# EAGLE design untitled (EAGLE 5.10)
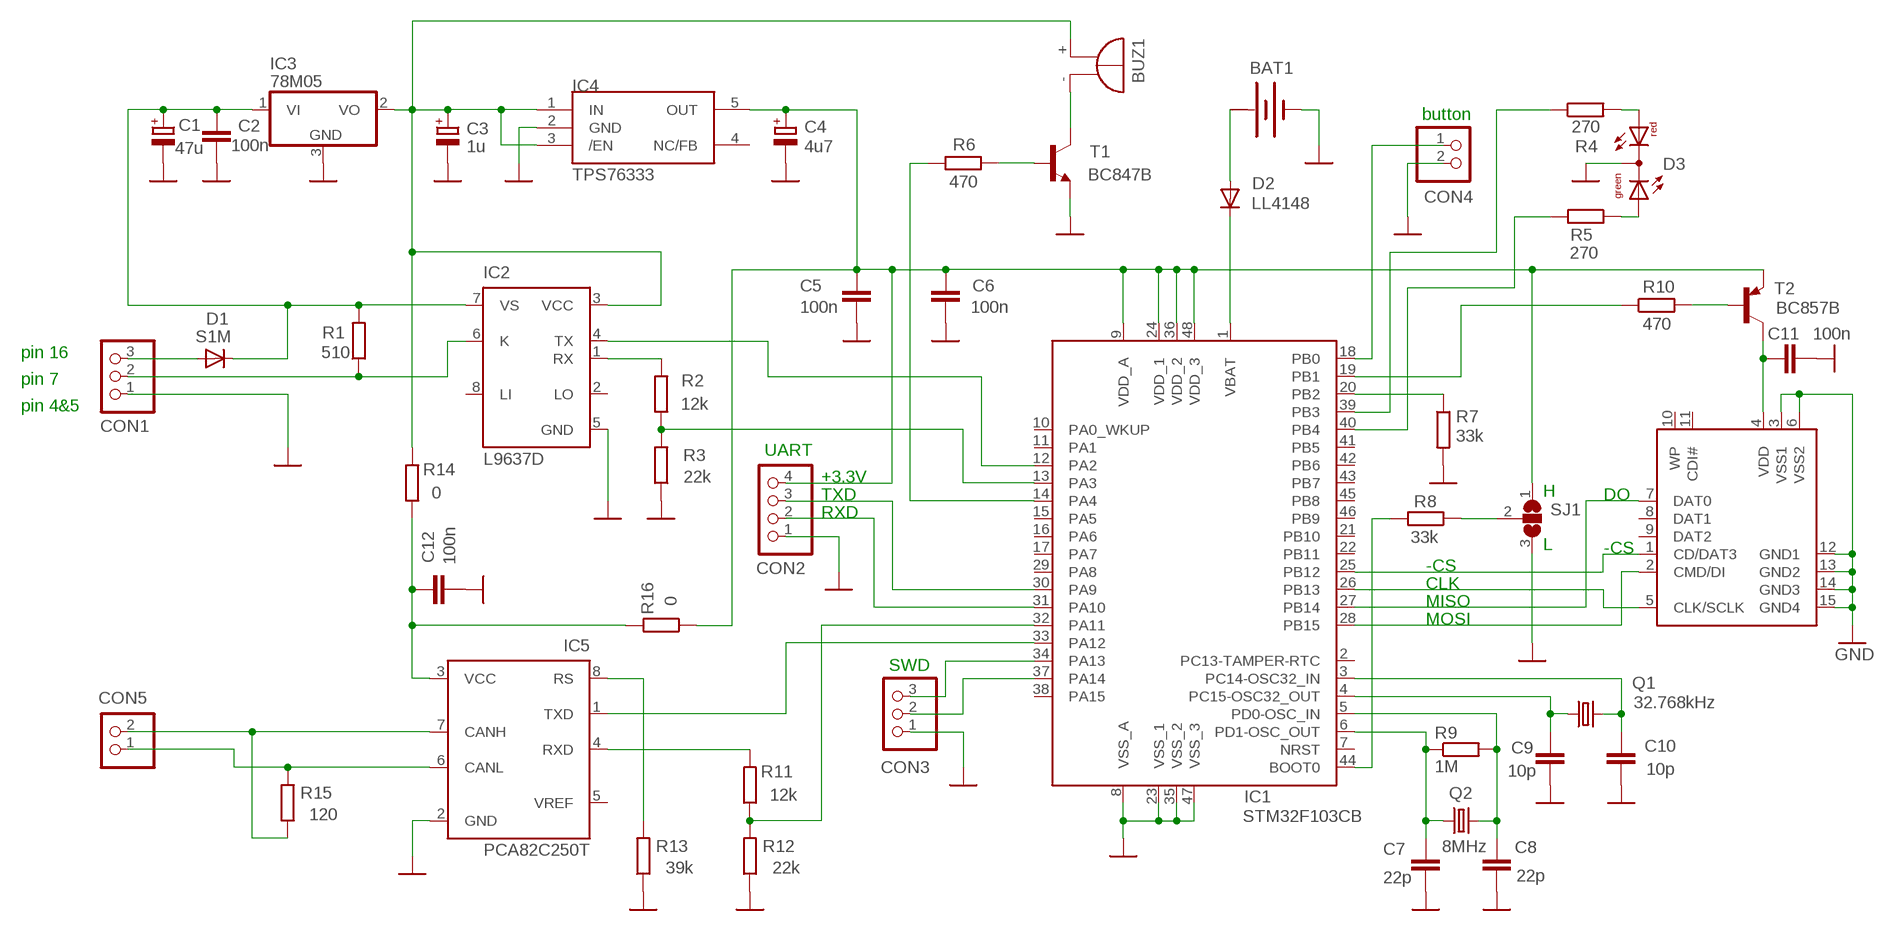
[diagram p0: schematic, sheet 1]

## Parts
BAT1  BATTERY  [BATTERY]
BUZ1  F/TMB  [F/TMB]
C1  47u  CPOL-EUE2.5-5  [E2,5-5]
C2  100n  C-EUC1206  [C1206]
C3  1u  CPOL-EUSMCA  [SMC_A]
C4  4u7  CPOL-EUSMCA  [SMC_A]
C5  100n  C-EUC0603  [C0603]
C6  100n  C-EUC0603  [C0603]
C7  22p  C-EUC0603  [C0603]
C8  22p  C-EUC0603  [C0603]
C9  10p  C-EUC0603  [C0603]
C10  10p  C-EUC0603  [C0603]
C11  100n  C-EUC0603  [C0603]
C12  100n  C-EUC0603  [C0603]
CON1  PINHD-1X3  [1X03]
CON2  PINHD-1X4  [1X04]
CON3  PINHD-1X3  [1X03]
CON4  PINHD-1X2  [1X02]
CON5  PINHD-1X2  [1X02]
D1  S1M  DIODE-SMB  [SMB]
D2  LL4148  DIODE-MINIMELF  [MINIMELF]
D3  DUOLED-RG-C  [DUOLED-C-5MM]
IC1  STM32F103CB  STM32F101RB  [LQFP48]
IC2  L9637D  [SO08]
IC3  78M05  7805DT  [TO252]
IC4  TPS76333  TPS769XX  [SOT23-5L]
IC5  PCA82C250T  [SO8]
Q1  32.768kHz  CRYSTALTC26H  [TC26H]
Q2  8MHz  CRYSTALHC49S  [HC49/S]
R1  510  R-EU_R1206  [R1206]
R2  12k  R-EU_R0603  [R0603]
R3  22k  R-EU_R0603  [R0603]
R4  270  R-EU_R0603  [R0603]
R5  270  R-EU_R0603  [R0603]
R6  470  R-EU_R0603  [R0603]
R7  33k  R-EU_R0603  [R0603]
R8  33k  R-EU_R0603  [R0603]
R9  1M  R-EU_R0603  [R0603]
R10  470  R-EU_R0603  [R0603]
R11  12k  R-EU_R0603  [R0603]
R12  22k  R-EU_R0603  [R0603]
R13  39k  R-EU_R0603  [R0603]
R14  0  R-EU_R0603  [R0603]
R15  120  R-EU_R0603  [R0603]
R16  0  R-EU_R0603  [R0603]
SJ1  SJ2W  [SJ_2]
T1  BC847B  BC847ALT1SMD  [SOT23]
T2  BC857B  BC857ALT1SMD  [SOT23-BEC]
U$2  SDCARDVAR1  [SDCMF-10915W010]

## Nets
GND: BAT1.- C1.- C2.2 C3.- C4.- C5.2 C6.2 C7.2 C8.2 C9.2 C10.2 C11.2 C12.2 CON1.1 CON2.1 CON3.1 CON4.2 D3.C IC1.8(VSS_A) IC1.23(VSS_1) IC1.35(VSS_2) IC1.47(VSS_3) IC2.5(GND) IC3.3(GND) IC4.2(GND) IC5.2(GND) R3.1 R7.2 R12.1 R13.1 SJ1.3 T1.2(E) U$2.3(VSS1) U$2.6(VSS2) U$2.12(GND1) U$2.13(GND2) U$2.14(GND3) U$2.15(GND4)
N$1: IC1.25(PB12) U$2.1(CD/DAT3)
N$2: IC1.19(PB1) R10.1
N$3: C8.1 IC1.5(PD0-OSC_IN) Q2.2 R9.2
N$4: C7.1 IC1.6(PD1-OSC_OUT) Q2.1 R9.1
N$5: R8.1 SJ1.2
N$6: D3.AR R4.2
N$7: IC1.28(PB15) U$2.2(CMD/DI)
N$8: C9.1 IC1.4(PC15-OSC32_OUT) Q1.1
N$9: C10.1 IC1.3(PC14-OSC32_IN) Q1.2
N$10: IC1.12(PA2) IC2.4(TX)
N$11: IC1.39(PB3) R4.1
N$12: BUZ1.+ C3.+ IC2.3(VCC) IC3.2(VO) IC4.1(IN) IC4.3(/EN) R14.2
N$13: IC1.13(PA3) R2.1 R3.2
N$14: IC2.1(RX) R2.2
N$16: CON1.2 IC2.6(K) R1.1
N$17: IC1.26(PB13) U$2.5(CLK/SCLK)
N$18: D2.C IC1.1(VBAT)
N$19: CON2.3 IC1.30(PA9)
N$20: IC1.40(PB4) R5.2
N$21: D3.AX(AG) R5.1
N$22: CON1.3 D1.A
N$23: CON3.3 IC1.34(PA13)
N$24: C1.+ C2.1 D1.C IC2.7(VS) IC3.1(VI) R1.2
N$25: IC1.20(PB2) R7.1
N$26: CON3.2 IC1.37(PA14)
N$27: BUZ1.- T1.3(C)
N$28: R10.2 T2.B
N$29: R6.2 T1.1(B)
N$30: IC1.14(PA4) R6.1
N$31: IC1.44(BOOT0) R8.2
N$32: C11.1 T2.C U$2.4(VDD)
N$33: CON2.2 IC1.31(PA10)
N$34: CON4.1 IC1.18(PB0)
N$36: BAT1.+ D2.A
N$37: IC1.27(PB14) U$2.7(DAT0)
N$44: IC1.33(PA12) IC5.1(TXD)
N$45: IC1.32(PA11) R11.1 R12.2
N$46: IC5.4(RXD) R11.2
N$47: IC5.8(RS) R13.2
N$48: CON5.2 IC5.7(CANH) R15.1
N$49: CON5.1 IC5.6(CANL) R15.2
N$50: C12.1 IC5.3(VCC) R14.1 R16.2
N$82: C4.+ C5.1 C6.1 CON2.4 IC1.9(VDD_A) IC1.24(VDD_1) IC1.36(VDD_2) IC1.48(VDD_3) IC4.5(OUT) R16.1 SJ1.1 T2.E
Unconnected: IC1.2(PC13-TAMPER-RTC) IC1.7(NRST) IC1.10(PA0_WKUP) IC1.11(PA1) IC1.15(PA5) IC1.16(PA6) IC1.17(PA7) IC1.21(PB10) IC1.22(PB11) IC1.29(PA8) IC1.38(PA15) IC1.41(PB5) IC1.42(PB6) IC1.43(PB7) IC1.45(PB8) IC1.46(PB9) IC2.2(LO) IC2.8(LI) IC4.4(NC/FB) IC5.5(VREF) U$2.8(DAT1) U$2.9(DAT2) U$2.10(WP) U$2.11(CDI#)

## Notes on the sheet
- button
- pin 16
- pin 7
- pin 4&5
- UART
- +3.3V
- TXD | H | DO
- RXD
- L | -CS
- -CS
- CLK
- MISO
- MOSI
- SWD

## Power pins joined to a net without a drawn wire
+: BAT1.+@1(+)

## Library data of the parts
BAT1 = special:BATTERY: BATTERY
BUZ1 = buzzer:F/TMB: BUZZER Source: Buerklin
C1 C3 C4 = rcl:CPOL-EU: POLARIZED CAPACITOR, European symbol
C2 C5-C12 = rcl:C-EU: CAPACITOR, European symbol
CON1 CON3 = pinhead:PINHD-1X3: PIN HEADER
CON2 = pinhead:PINHD-1X4: PIN HEADER
CON4 CON5 = pinhead:PINHD-1X2: PIN HEADER
D1 D2 = diode:DIODE-: DIODE
D3 = led:DUOLED-RG-C: DUO LED 2 colors (red/green), 5 mm, round, common Cathode www.ligitek.com or other producers.
IC1 = stm32:STM32F101RB
IC2 = st-microelectronics:L9637D: ISO 9141 INTERFACE Source: 1765.pdf
IC3 = linear:78*: Positive VOLTAGE REGULATOR Source: http://cache.national.com/ds/LM/LM78L05.pdf http://www.fairchildsemi.com/ds/LM/LM7805.pdf
IC4 = tps769xx:TPS769XX
IC5 = micro-philips:PCA82C250: CAN CONTROLLER INTERFACE
Q1 Q2 = crystal:CRYSTAL: CRYSTAL
R1-R16 = rcl:R-EU_: RESISTOR, European symbol
SJ1 = jumper:SJ2W: SMD solder JUMPER
T1 = transistor-npn:BC847*: NPN Transistor
T2 = transistor-pnp:BC857*: PNP Transistror
U$2 = kingfont_sdcmf10915w010:SDCARD: SD card connector KINGFONT SDCMF-10915W010

## Board
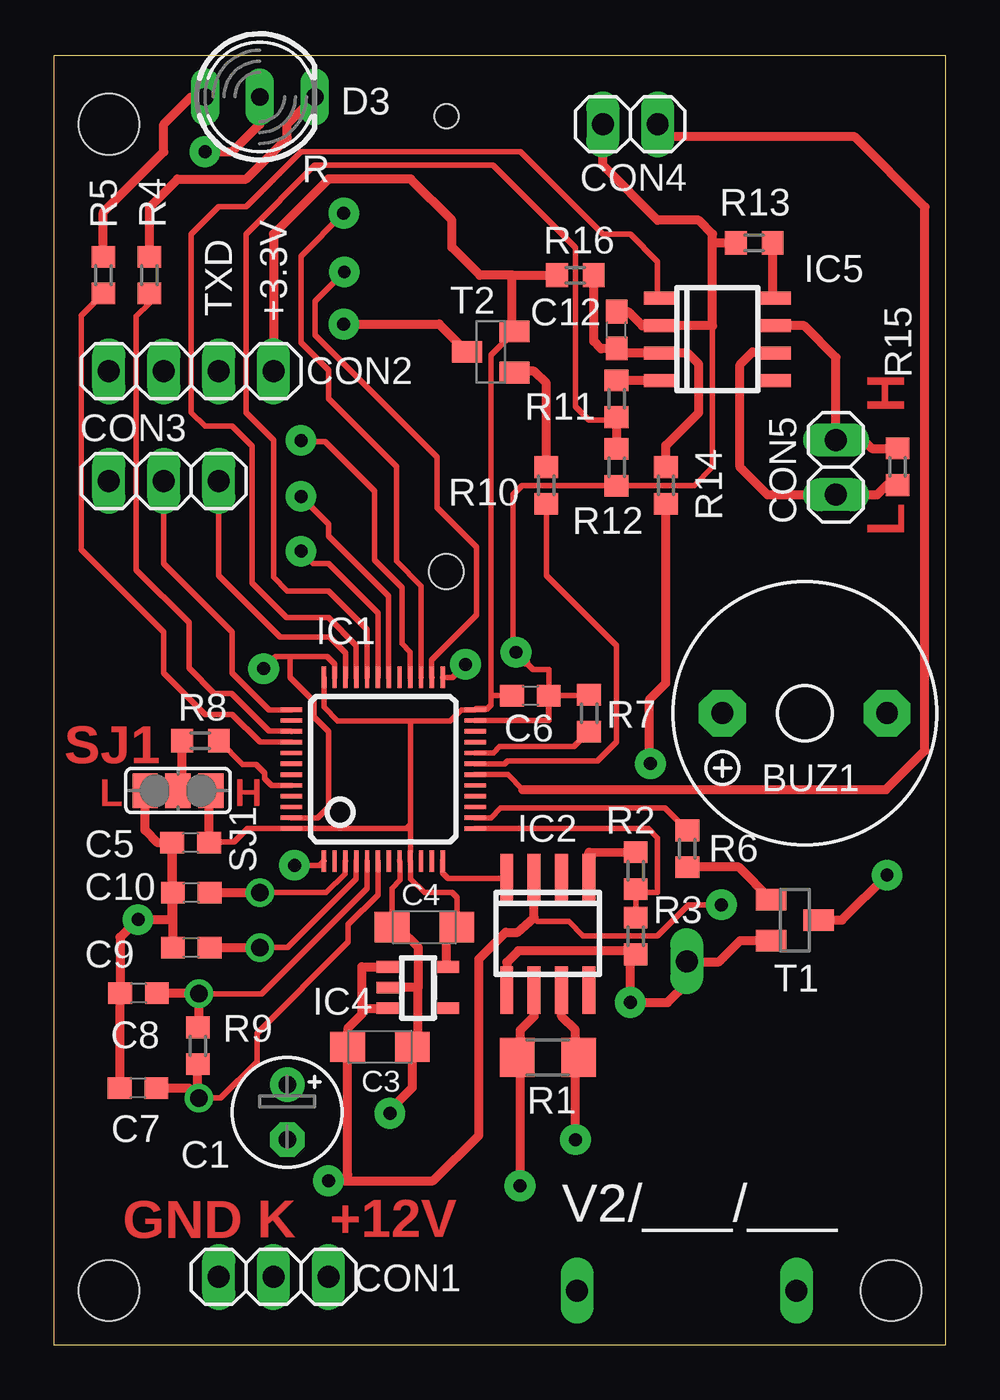
[diagram p1: board, top side]
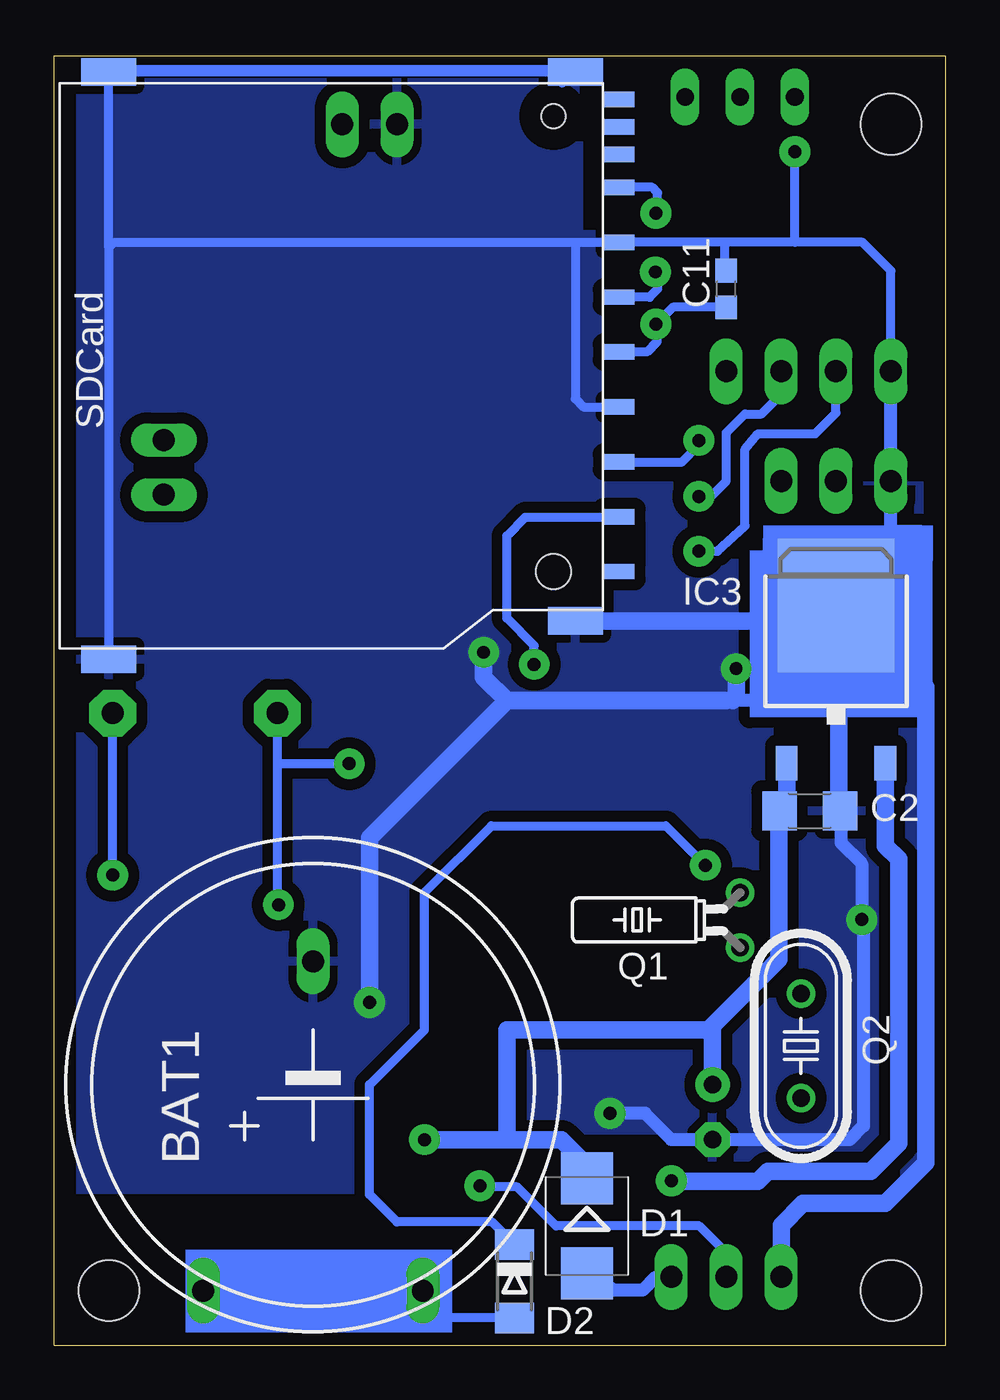
[diagram p2: board, bottom side, seen from below]

Size 41.28 x 59.69 mm. Coordinates in mm from the lower left corner, seen from the top.
Outline: 41.28,0 0,0 0,59.69 41.28,59.69 41.28,0
Copper layers (1*16): Top 0.035mm / dielectric 1.5mm / Bottom 0.035mm
Design rules "default *": minimum track width 10mil, minimum drill 24mil, track to track 20mil, track to pad 20mil, pad to pad 20mil, via to via 20mil, smd to smd 8mil, copper to edge 40mil, drill to drill 8mil, minimum pad ring 10mil, minimum via ring 8mil, stop-mask expansion 1mil, vias tented up to drill 0mil, thermal gap 15mil
Holes 2.8 mm at 2.54,2.54 2.54,56.52 38.73,2.54
bRestrict: area 0.6,40 to 5.7,45.1; area 5.1,0.7 to 8.7,4.4; area 18.4,1.9 to 22.9,4.4; area 21,3.8 to 26,7; area 25.4,4.4 to 41.3,7; area 0.6,40 to 15.9,59.1; area 13.9,36.2 to 17.3,37.8; area 18.2,32.7 to 20,34.4; area 15.4,33.5 to 17.7,35.2; area 14.7,51.6 to 16.8,57.5; area 3.4,27.3 to 6.7,28.7; area 3.6,25.3 to 6.5,27.8; 2 more areas

### Footprints (pad centres in the part's own frame; a part is rotated, then mirrored left to right if it is on the bottom)
BATTERY = drill 1.016 long: + 9.525,-5.08; +@1 9.525,5.08; - -5.715,0
F/TMB = drill 1.016 pad 2.159 octagon: + 3.81,0; - -3.81,0
E2,5-5 = drill 0.813 pad 1.6 round: + -1.27,0 | drill 0.813 pad 1.6 octagon: - 1.27,0
C1206 = smd 1.6 x 1.8: 1 -1.4,0; 2 1.4,0
SMC_A = smd 1.6 x 1.4: + -1.5,0; - 1.5,0
C0603 = smd 1.1 x 1: 1 -0.85,0; 2 0.85,0
1X03 = drill 1.016 long: 1 -2.54,0; 2 0,0; 3 2.54,0
1X04 = drill 1.016 long: 1 -3.81,0; 2 -1.27,0; 3 1.27,0; 4 3.81,0
1X02 = drill 1.016 long: 1 -1.27,0; 2 1.27,0
SMB = smd 2.4 x 2.4: A 2.2,0; C -2.2,0
MINIMELF = smd 1.4 x 1.8: A 1.7,0; C -1.7,0
DUOLED-C-5MM = drill 0.813 long: AR 2.54,0; AX -2.54,0; C 0,0
LQFP48 = smd 0.2 x 1: 1 -2.75,-4.25; 2 -2.25,-4.25; 3 -1.75,-4.25; 4 -1.25,-4.25; 5 -0.75,-4.25; 6 -0.25,-4.25; 7 0.25,-4.25; 8 0.75,-4.25; 9 1.25,-4.25; 10 1.75,-4.25; 11 2.25,-4.25; 12 2.75,-4.25; 25 2.75,4.25; 26 2.25,4.25; 27 1.75,4.25; 28 1.25,4.25; 29 0.75,4.25; 30 0.25,4.25; 31 -0.25,4.25; 32 -0.75,4.25; 33 -1.25,4.25; 34 -1.75,4.25; 35 -2.25,4.25; 36 -2.75,4.25 | smd 1 x 0.2: 13 4.25,-2.75; 14 4.25,-2.25; 15 4.25,-1.75; 16 4.25,-1.25; 17 4.25,-0.75; 18 4.25,-0.25; 19 4.25,0.25; 20 4.25,0.75; 21 4.25,1.25; 22 4.25,1.75; 23 4.25,2.25; 24 4.25,2.75; 37 -4.25,2.75; 38 -4.25,2.25; 39 -4.25,1.75; 40 -4.25,1.25; 41 -4.25,0.75; 42 -4.25,0.25; 43 -4.25,-0.25; 44 -4.25,-0.75; 45 -4.25,-1.25; 46 -4.25,-1.75; 47 -4.25,-2.25; 48 -4.25,-2.75
SO08 = smd 0.6 x 2.2: 1 -1.905,-2.6; 2 -0.635,-2.6; 3 0.635,-2.6; 4 1.905,-2.6; 5 1.905,2.6; 6 0.635,2.6; 7 -0.635,2.6; 8 -1.905,2.6
TO252 = smd 1 x 1.6: 1 -2.28,-4.8; 2 2.28,-4.8 | smd 5.4 x 6.2: 3 0,2.5
SOT23-5L = smd 0.55 x 1.2: 1 -0.95,-1.3; 2 0,-1.3; 3 0.95,-1.3; 4 0.95,1.3; 5 -0.95,1.3
SO8 = smd 0.6 x 1.6: 1 -1.905,-2.6; 2 -0.635,-2.6; 3 0.635,-2.6; 4 1.905,-2.6; 5 1.905,2.6; 6 0.635,2.6; 7 -0.635,2.6; 8 -1.905,2.6
TC26H = drill 0.813 round: 1 -1.27,0; 2 1.27,0
HC49/S = drill 0.813 round: 1 -2.413,0; 2 2.413,0
R1206 = smd 1.6 x 1.803: 1 -1.422,0; 2 1.422,0
R0603 = smd 1 x 1.1: 1 -0.85,0; 2 0.85,0
SJ_2 = smd 1.168 x 1.6: 1 -1.524,0; 2 0,0; 3 1.524,0
SOT23 = smd 1 x 1.4: 1 -0.95,-1.1; 2 0.95,-1.1; 3 0,1.1
SOT23-BEC = smd 1 x 1.4: B -0.95,-1.1; C 0,1.1; E 0.95,-1.1
SDCMF-10915W010 = smd 0.711 x 1.422: 1 7.366,13.462; 2 4.826,13.462; 3 2.286,13.462; 4 -0.254,13.462; 5 -2.794,13.462; 6 -5.334,13.462; 7 -7.874,13.462; 8 -9.398,13.462; 9 9.906,13.462; 10 -11.938,13.462; 11 -10.668,13.462 | smd 1.27 x 2.54: 12 12.192,11.43; 13 13.97,-10.16; 14 -13.208,-10.16; 15 -13.208,11.43 | hole 1.6: 9.906,10.414 | hole 1.1: -11.176,10.414

### Placement (x,y rotation side)
BAT1  29.29,12.06 270 bottom
BUZ1  34.75,29.26 180 top
C1  10.8,10.79 270 top
C2  6.3,24.74 0 bottom
C3  15.09,13.82 0 top
C4  17.15,19.35 180 top
C5  6.32,23.27 180 top
C6  22.05,30.07 0 top
C7  3.89,11.91 180 top
C8  3.91,16.31 180 top
C9  6.35,18.41 180 top
C10  6.35,20.95 180 top
C11  10.16,48.9 90 bottom
C12  26.04,46.99 90 top
CON1  10.16,3.17 0 top
CON2  6.35,45.09 0 top
CON3  5.08,40.01 0 top
CON4  26.67,56.52 180 top
CON5  36.2,40.64 90 top
D1  16.61,5.54 270 bottom
D2  19.96,2.97 270 bottom
D3  9.52,57.79 0 top
IC1  15.24,26.67 0 top
IC2  22.86,19.05 180 top
IC3  5.08,31.75 0 bottom
IC4  16.84,16.56 270 top
IC5  30.71,46.56 270 top
Q1  9.52,19.69 90 bottom
Q2  6.71,13.87 90 bottom
R1  22.86,13.33 0 top
R2  26.92,21.97 90 top
R3  26.92,18.95 90 top
R4  4.42,49.53 90 top
R5  2.29,49.53 270 top
R6  29.31,22.99 270 top
R7  24.77,29.26 90 top
R8  6.78,27.99 0 top
R9  6.65,13.87 90 top
R10  22.78,39.8 90 top
R11  26.04,43.82 90 top
R12  26.04,40.64 90 top
R13  32.41,51.03 0 top
R14  28.32,39.8 270 top
R15  39.04,40.67 270 top
R16  24.13,49.53 0 top
SJ1  5.74,25.68 180 top
T1  34.29,19.69 270 top
T2  20.22,45.97 90 top
U$2  28.58,45.72 270 bottom

### Tracks (layer width: path | path; a pad name or v marks a point on that pad's centre or on a via)
GND  (via drill 0.6 pad 1.42)
  Top 0.254: IC1.47 12.2,24.42 12.7,24.92 12.7,28.42 12.04,29.08 12.04,29.79 10.92,30.91 10.92,31.88 | 10.92,31.88 10.26,31.88 v9.7,31.32 | IC1.35 12.99,31.54 12.65,31.88 10.92,31.88 | R3.1 26.76,18.26 | 30.48,47.19 30.48,40.64 29.63,39.79 R12.1 21.65,39.79 21.23,39.37 21.23,32.23 v21.39,32.08 22.17,31.29 22.91,31.29 22.91,28.92 IC1.23 22.9,28.92 C6.2 24.77,30.07 R7.2 | IC1.8 16.03,22.38 16.03,21.54 15.65,21.16 C4.- 15.93,19.35 | 16.84,16.56 16.87,16.59
  Top 0.305: 2.92,16.05 2.96,16.09
  Top 0.406: C8.2 3.06,16.19 2.92,16.05 | v21.39,32.08 21.84,31.62 | R3.1 26.67,17.84 v26.67,15.87 28.4,15.87 29.29,16.76 BAT1.- 29.31,17.76 30.78,17.76 31.77,18.73 T1.2 | IC2.5 20.95,17.73 21.49,18.26 26.76,18.26 | CON4.2 25.4,54.61 27.94,52.07 29.84,52.07 30.48,51.44 30.48,51.03 | D3.C 9.52,56.52 8.26,55.24 v6.98,55.24 | 30.48,51.03 R13.1 | 30.48,51.03 30.48,47.19 IC5.2 27.23,47.19 26.58,47.84 C12.2 | IC4.2 16.84,16.56 16.84,14.07 C3.- 16.59,11.94 15.6,10.95 15.6,10.79 | 16.87,16.59 16.87,18.41 15.93,19.35 | C9.2 C10.2 5.48,20.95 C5.2 | SJ1.3 4.22,23.85 4.8,23.27 C5.2 | C8.2 3.06,18.89 v3.89,19.71 5.51,19.71 5.48,19.75 C5.2 | C7.2 3.04,16.28 C8.2
  Top 0.61: v15.55,10.74 15.6,10.79
  Bottom 0.254: 5.08,33.02 5.61,32.49 6.01,32.09 6.38,31.73
  Bottom 0.406: 6.01,32.09 6.01,31.9 | 10.24,51.05 U$2.6 15.14,51.03 17.15,51.03 | U$2.14 U$2.15 16.64,58.93 16.51,59.05 17.12,59.05 | 17.12,59.05 38.73,59.05 38.73,50.8 | 38.73,50.8 U$2.13 | 2.86,36.51 2.54,36.83 | 2.46,36.91 2.54,36.98 | C11.2 10.24,49.75 10.24,51.05 | CON2.1 2.54,49.73 3.86,51.05 6.98,51.05 | 6.98,51.05 10.24,51.05 | 6.98,51.05 v6.98,55.24 | 17.12,59.05 17.76,58.42 | U$2.3 16.76,43.43 17.15,43.82 17.15,51.03 | 17.15,51.03 38.51,51.03 38.73,50.8
  Bottom 0.61: 5.08,34.29 4.95,34.16 4.95,33.55 4.95,33.02 4.95,29.84 9.86,29.84 10.16,29.84 | v15.55,10.74 13.92,10.74 12.7,9.53 C1.- 4.45,9.53 3.81,10.16 3.81,19.63 v3.89,19.71 3.89,22.3 4.85,23.27 4.85,24.69 C2.2 | 2.54,36.98 CON3.1 CON2.1
  Bottom 0.813: 5.08,33.02 4.95,33.02 | IC3.3 5.08,34.29 2.86,36.51 2.46,36.91 | U$2.13 38.56,31.57 | v26.67,15.87 26.67,23.5 20.32,29.84 | 10.16,29.84 20.32,29.84 | v21.39,32.08 21.39,30.91 20.32,29.84 | U$2.12 4.98,33.53 4.95,33.55 | v9.7,31.32 9.7,30 9.86,29.84 | 4.95,29.84 4.95,24.79 C2.2 | CON1.1 7.62,5.56 6.6,6.58 2.79,6.58 0.91,8.46 0.91,30.48 2.79,32.36 5.49,32.36 5.61,32.49
  pour Bottom: 0,59.66 0,-0.08 41.25,-0.08 41.25,59.46
N$1  (via drill 0.6 pad 1.42)
  Top 0.254: IC1.25 18.45,30.92 v19.05,31.52
  Bottom 0.254: 15.14,38.33 U$2.1
  Bottom 0.406: 15.14,38.33 19.46,38.33 20.32,37.47 20.32,33.66 19.05,32.38 v19.05,31.52
N$2
  Top 0.254: IC1.19 20.85,26.92 20.98,27.05 25.15,27.05 26.04,27.94 26.04,32.38 22.78,35.64 R10.1
N$3
  Top 0.254: IC1.5 14.48,22.41 14.48,21.16 9.6,16.28 Q2.2
  Top 0.406: Q2.2 6.55,16.43 | Q2.2 6.71,14.77 R9.2 | C8.1 6.71,16.31 Q2.2
N$4
  Top 0.254: IC1.6 14.99,20.86 13.61,19.48 13.61,18.67 9.4,14.45 9.4,13.13 7.72,11.46 Q2.1
  Top 0.406: C7.1 6.25,11.91 Q2.1 6.66,11.51 R9.1
N$5
  Top 0.254: SJ1.2 5.93,25.62
  Top 0.406: 5.93,25.62 R8.1
N$6
  Top 0.406: R4.2 4.42,52.68 5.72,53.98 8.89,53.98 10.8,55.88 10.8,56.52 D3.AR
N$7  (via drill 0.6 pad 1.42)
  Top 0.254: IC1.28 16.49,32.1 16.1,32.49 16.1,35.08 14.83,36.35 14.83,39.55 12.55,41.83 11.48,41.83 v11.43,41.88
  Bottom 0.254: v11.43,41.88 11.43,41.68 | 15.09,40.87 U$2.2
  Bottom 0.406: 11.43,41.68 12.24,40.87 15.09,40.87
N$8
  Top 0.254: IC1.4 13.99,21.59 10.82,18.41 Q1.1
  Top 0.406: C9.1 Q1.1
N$9
  Top 0.254: Q1.2 12.6,20.95 13.46,21.82 13.46,22.39 IC1.3
  Top 0.406: C10.1 Q1.2
N$10
  Top 0.254: IC1.12 17.99,21.86 18.24,21.62 20.85,21.62 20.9,21.67 20.92,21.65 IC2.4
N$11
  Top 0.254: R4.1 4.42,48.23 3.81,47.62 3.81,35.89 6.25,33.45 6.25,31.34 7.42,30.18 8.23,30.18 9.96,28.45 10.96,28.45 IC1.39
N$12  (via drill 0.6 pad 1.42)
  Top 0.254: v30.89,20.4 29.36,20.4 27.94,18.95 24.49,18.95 23.83,19.63 22.38,19.63 22.23,19.79 | v27.61,26.92 27.56,26.98 | 15.52,17.53 IC4.1 | 14.37,15.61 14.25,15.49 14.25,15.34 | C3.+ 13.61,13.84
  Top 0.406: v12.7,7.62 13.31,7.62 | 13.31,7.62 17.55,7.62 19.66,9.73 19.66,17.88 20.9,19.13 21.46,19.13 22.23,19.79 IC2.3 | R14.2 28.32,30.66 27.56,29.9 27.56,26.98 | 15.52,17.53 14.25,17.53 14.25,15.49 | 14.37,15.61 IC4.3 | C3.+ 13.59,7.9 13.31,7.62 | 14.25,15.34 13.61,14.71 13.61,13.84
  Bottom 0.254: 30.94,26.77 30.78,26.92
  Bottom 0.406: BUZ1.+ 30.94,26.77 30.94,20.45 v30.89,20.4 | 30.78,26.92 v27.61,26.92
  Bottom 0.813: IC3.2 2.8,23.12 2.18,22.5 2.18,9.35 3.48,8.05 8.23,8.05 8.69,7.6 12.68,7.6 v12.7,7.62
N$13
  Top 0.254: R3.2 R2.1 26.96,20.95 27.94,20.95 27.94,23.5 27.52,23.92 IC1.13
N$14
  Top 0.254: 24.9,22.69 24.69,22.48 24.69,21.73 IC2.1
  Top 0.406: 24.9,22.69 24.77,22.69 24.77,22.84 R2.2
N$15  (via drill 0.6 pad 1.42)
  other vias: 13.44,49.68
N$16  (via drill 0.6 pad 1.42)
  Top 0.406: IC2.6 22.23,15.24 21.59,14.6 21.59,13.33 R1.1 21.59,13.18 21.59,7.42 v21.57,7.39
  Bottom 0.406: CON1.2 10.16,4.29 11.41,5.54 18.03,5.54 19.84,7.34 21.51,7.34 v21.57,7.39
N$17  (via drill 0.6 pad 1.42)
  Top 0.254: IC1.26 17.48,30.94 17.48,31.73 19.56,33.81 19.56,36.96 17.73,38.79 17.73,41.12 12.09,46.76 12.09,48.34 v13.44,49.68
  Bottom 0.406: U$2.5 13.72,48.51 13.34,48.9 13.34,49.58 v13.44,49.68
N$18  (via drill 0.6 pad 1.42)
  Top 0.254: v11.12,22.23 12.3,22.23 IC1.1
  Bottom 0.406: v11.12,22.23 12.95,24.05 21.03,24.05 24.13,20.95 24.13,14.6 26.67,12.06 26.67,6.99 25.4,5.71 21.01,5.71 D2.C
N$19  (via drill 0.6 pad 1.42)
  Top 0.254: IC1.30 15.49,34.68 12.7,37.47 12.7,38.02 v11.43,39.29
  Bottom 0.406: CON2.3 7.62,44.02 8.53,43.1 9.3,43.1 10.16,42.24 10.16,40.01 10.87,39.29 v11.43,39.29
N$20
  Top 0.254: IC1.40 9.55,27.92 8.26,29.21 6.98,29.21 5.08,31.12 5.08,33.02 1.27,36.83 1.27,47.66 R5.2
N$21
  Top 0.406: R5.1 2.29,52.45 5.08,55.24 5.08,56.52 6.35,57.79 D3.AX
N$22
  Bottom 0.61: CON1.3 13.41,3.17 14.02,2.56 15.34,2.56 D1.A
N$23
  Top 0.254: IC1.34 13.49,32.05 12.75,32.79 10.47,32.79 7.62,35.64 CON3.3
N$24  (via drill 0.6 pad 1.42)
  Top 0.406: IC2.7 23.5,15.24 24.13,14.6 24.13,13.33 | 24.13,13.33 R1.2 | v24.13,9.53 24.13,13.33
  Bottom 0.61: 16.51,8.26 16.51,7.84 D1.C
  Bottom 0.813: IC3.1 7.36,25.08 C2.1 7.72,24.72 7.72,17.86 10.8,14.78 10.8,14.6 | C1.+ 10.8,14.6 | 20.32,9.53 v24.13,9.53 | 20.32,9.53 20.32,14.6 10.8,14.6 | 20.32,9.53 17.78,9.53 16.51,8.26
N$25
  Top 0.254: IC1.20 20.33,27.42 20.62,27.71 24.07,27.71 R7.1
N$26
  Top 0.254: CON3.2 5.08,36.2 8.26,33.02 8.26,31.12 9.95,29.42 IC1.37
N$27  (via drill 0.6 pad 1.42)
  Top 0.406: T1.3 36.47,19.69 v38.56,21.77
  Bottom 0.406: v38.56,21.77 BUZ1.-
N$28
  Top 0.254: 21.38,45.09 T2.B
  Top 0.406: R10.2 22.78,44.53 22.23,45.09 21.38,45.09
N$29
  Top 0.406: R6.2 31.69,22.14 T1.1
N$30
  Top 0.254: IC1.14 20.23,24.42 20.68,24.87 28.28,24.87 R6.1
N$31
  Top 0.254: IC1.44 10.07,25.92 9.75,26.24 9.75,26.49 9.35,26.9 8.72,26.9 R8.2 7.66,28.02
N$32  (via drill 0.6 pad 1.42)
  Top 0.406: v13.41,47.27 17.82,47.27 T2.C
  Bottom 0.254: v13.41,47.27 13.36,47.22
  Bottom 0.406: U$2.4 13.84,45.97 13.36,46.46 13.36,47.22 | C11.1 12.64,48.05 v13.41,47.27
N$33  (via drill 0.6 pad 1.42)
  Top 0.254: IC1.31 14.99,33.91 12.7,36.2 11.99,36.2 v11.43,36.75
  Bottom 0.254: CON2.2 5.08,44.22
  Bottom 0.406: v11.43,36.75 10.57,36.75 9.3,37.92 9.3,41.48 8.69,42.19 6.05,42.19 5.08,43.16 CON2.2
N$34
  Top 0.254: IC1.18 21,26.42 21.69,25.73
  Top 0.406: CON4.1 28.52,55.93 37.06,55.93 40.31,52.68 40.31,27.53 38.51,25.73 21.69,25.73
N$36
  Bottom 0.406: D2.A 23.09,1.27 24.33,2.51 34.34,2.51 BAT1.+
N$37  (via drill 0.6 pad 1.42)
  Top 0.254: v13.41,52.4 11.43,50.42 11.43,46.41 12.7,45.14 12.7,43.82 15.85,40.66 15.85,36.3 16.99,35.16 IC1.27
  Bottom 0.254: 15.09,53.57 U$2.7 15.09,53.62
  Bottom 0.406: U$2.7 13.59,53.59 13.34,53.34 13.34,52.48 v13.41,52.4
N$42  (via drill 0.6 pad 0.81)
  other vias: 18.16,56.9
N$43  (via drill 0.6 pad 0.81)
  other vias: 18.16,35.79
N$44
  Top 0.254: IC1.33 13.99,32.39 12.7,33.68 10.77,33.68 9.17,35.28 9.17,41.63 8.26,42.55 6.98,42.55 6.35,43.18 6.35,51.44 7.62,52.7 8.89,52.7 11.43,55.24 21.59,55.24 25.4,51.44 26.67,51.44 27.94,50.16 27.94,48.63 IC5.1 28.08,48.49
N$45
  Top 0.254: IC1.32 14.49,33.13 12.7,34.93 10.8,34.93 10.16,35.56 10.16,41.91 8.89,43.18 8.89,51.44 12.07,54.61 20.32,54.61 24.13,50.8 24.13,43.46 24.77,42.82 25.89,42.82 R11.1
  Top 0.406: R11.1 R12.2
N$46
  Top 0.254: 28.1,44.66 IC5.4
  Top 0.406: R11.2 28.1,44.66
N$47
  Top 0.406: IC5.8 33.26,48.46 R13.2
N$48
  Top 0.406: IC5.7 34.72,47.19 36.2,45.72 CON5.2 37.47,41.91 37.86,41.52 R15.1
N$49
  Top 0.406: IC5.6 33.26,45.97 32.33,45.97 31.75,45.39 31.75,40.64 33.02,39.37 CON5.1 38.1,39.37 38.55,39.82 R15.2
N$50
  Top 0.254: 26.25,45.92 C12.1 26.02,46.13
  Top 0.406: 26.25,45.92 IC5.3 29.34,45.92 29.84,45.41 29.84,43.18 28.32,41.66 R14.1 | R16.2 24.98,46.47 25.32,46.13 26.02,46.13
N$82
  Top 0.254: 16.48,28.91 13.13,28.91 12.5,29.54 12.5,30.91 IC1.36 | 16.48,28.91 18.34,28.91 18.85,29.42 IC1.24 19.56,29.49 20.07,29.49 | 16.51,23.93 16.51,22.86 16.49,22.84 IC1.9 16.51,22.4 16.51,21.59 17.15,20.95 18.41,20.95 18.65,20.73 C4.+ 18.14,18.85 | 16.51,24.11 16.51,23.93 | 16.51,24.11 16.51,28.88 16.48,28.91 | 16.51,23.93 16.48,23.93 16.48,23.92 | T2.E 20.89,46.92 | 20.07,29.49 20.07,29.46 | 20.07,29.49 20.22,29.64 20.22,30 | C6.1 20.3,30.07 20.22,30 | 16.51,24.11 16.33,23.92 IC1.48 8.96,23.92 8.33,23.29 7.2,23.29 C5.1 | T2.E 20.22,45.82 20.22,30 | SJ1.1 7.32,25.63 7.18,25.63 | 21.23,49.53 21.21,49.55 21.18,49.53 | T2.E 21.21,47.03
  Top 0.406: C5.1 7.18,25.63 | 18.14,18.85 IC4.5 | 21.23,49.53 R16.1 | 21.21,47.03 21.21,49.55 | 21.18,49.53 19.71,49.53 18.41,50.83 18.41,52.07 16.51,53.98 12.7,53.98 10.16,51.44 CON2.4
(copper drawn outside any net)
  shapes: Bottom area x7

### Text on the board
Top: H | L | SJ1 | L | H | GND | K | +12V
tNames: R | +3.3V | TXD | V2/___/___